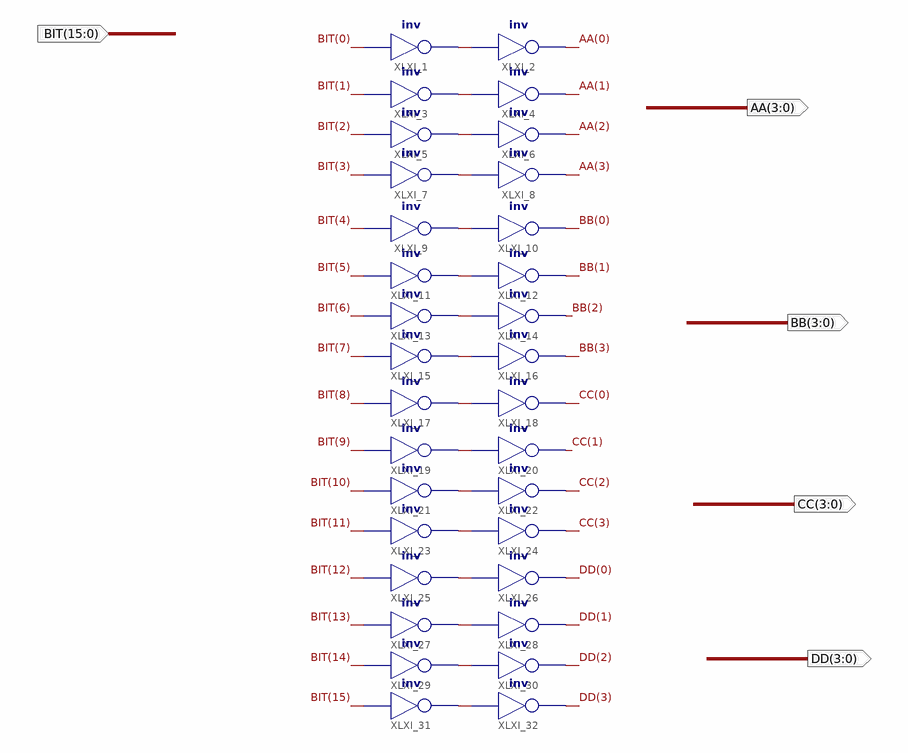
[diagram p0: schematic sheet 1]
// Xilinx ISE schematic MixBus16_4_V2.sch (spartan6) as structural Verilog: 32 symbols, 5 ports
module MixBus16_4_V2 (
  input  [15:0] BIT,
  output [3:0] AA,
  output [3:0] BB,
  output [3:0] CC,
  output [3:0] DD
);

  wire XLXN_1, XLXN_2, XLXN_3, XLXN_4, XLXN_5, XLXN_6, XLXN_7, XLXN_8, XLXN_9, XLXN_10, XLXN_11, XLXN_12,
       XLXN_13, XLXN_14, XLXN_15, XLXN_16;

  not XLXI_1 (XLXN_1, BIT[0]);
  not XLXI_2 (AA[0], XLXN_1);
  not XLXI_3 (XLXN_2, BIT[1]);
  not XLXI_4 (AA[1], XLXN_2);
  not XLXI_5 (XLXN_3, BIT[2]);
  not XLXI_6 (AA[2], XLXN_3);
  not XLXI_7 (XLXN_4, BIT[3]);
  not XLXI_8 (AA[3], XLXN_4);
  not XLXI_9 (XLXN_5, BIT[4]);
  not XLXI_10 (BB[0], XLXN_5);
  not XLXI_11 (XLXN_6, BIT[5]);
  not XLXI_12 (BB[1], XLXN_6);
  not XLXI_13 (XLXN_7, BIT[6]);
  not XLXI_14 (BB[2], XLXN_7);
  not XLXI_15 (XLXN_8, BIT[7]);
  not XLXI_16 (BB[3], XLXN_8);
  not XLXI_17 (XLXN_9, BIT[8]);
  not XLXI_18 (CC[0], XLXN_9);
  not XLXI_19 (XLXN_10, BIT[9]);
  not XLXI_20 (CC[1], XLXN_10);
  not XLXI_21 (XLXN_11, BIT[10]);
  not XLXI_22 (CC[2], XLXN_11);
  not XLXI_23 (XLXN_12, BIT[11]);
  not XLXI_24 (CC[3], XLXN_12);
  not XLXI_25 (XLXN_13, BIT[12]);
  not XLXI_26 (DD[0], XLXN_13);
  not XLXI_27 (XLXN_14, BIT[13]);
  not XLXI_28 (DD[1], XLXN_14);
  not XLXI_29 (XLXN_15, BIT[14]);
  not XLXI_30 (DD[2], XLXN_15);
  not XLXI_31 (XLXN_16, BIT[15]);
  not XLXI_32 (DD[3], XLXN_16);
endmodule
